# EAGLE schematic pmod_clock.961c7fa4 (EAGLE 6.5.4)
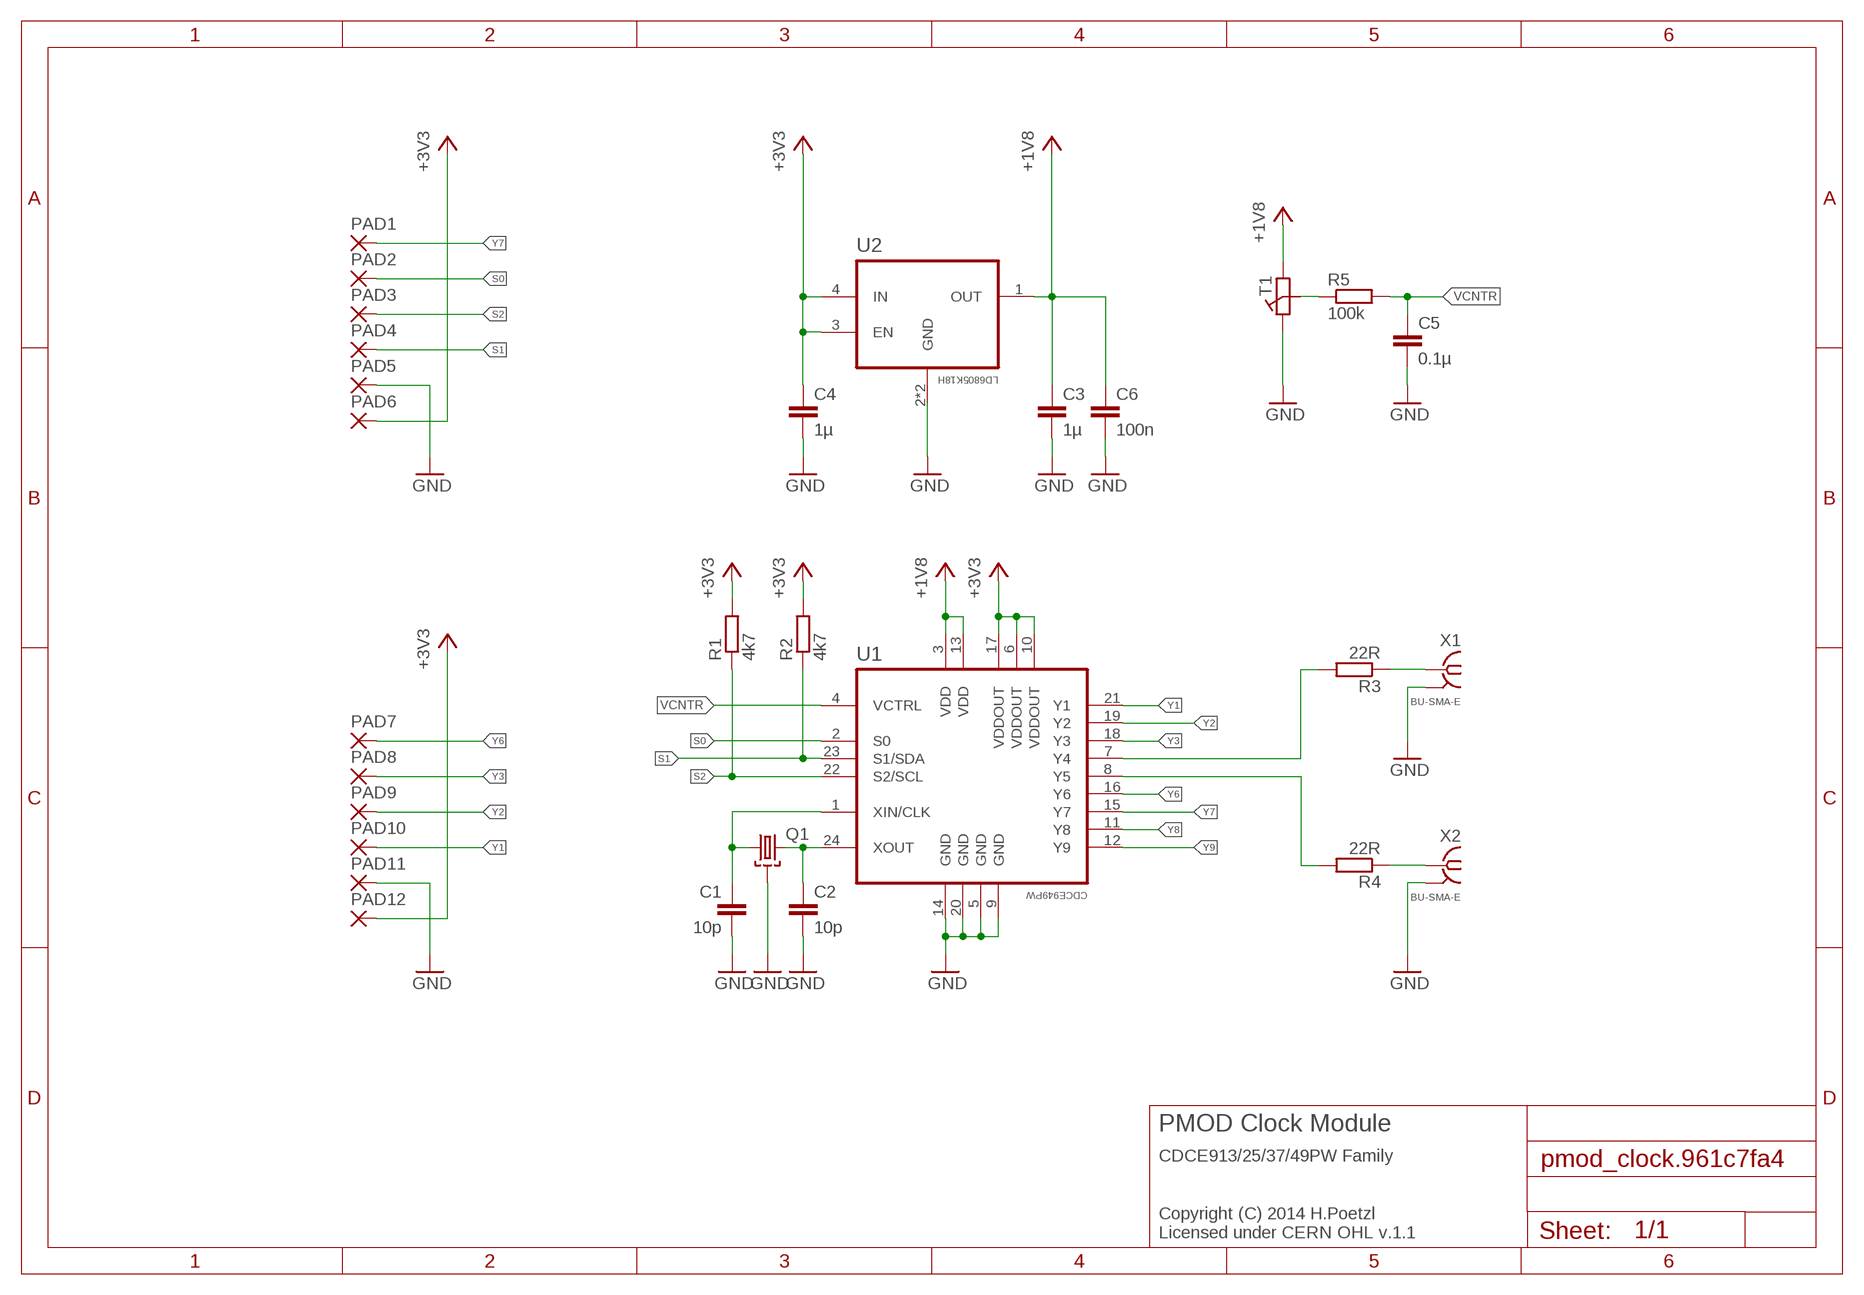
[diagram p0: schematic, sheet 1]

## Parts
C1  10p  C-EUC0402K  [C0402K]
C2  10p  C-EUC0402K  [C0402K]
C3  1µ  C-EUC0402  [C0402]
C4  1µ  C-EUC0402  [C0402]
C5  0.1µ  C-EUC0402  [C0402]
C6  100n  C-EUC0402  [C0402]
PAD1  SMD2HR  [SMD1.27-3.175HR]
PAD2  SMD2HR  [SMD1.27-3.175HR]
PAD3  SMD2HR  [SMD1.27-3.175HR]
PAD4  SMD2HR  [SMD1.27-3.175HR]
PAD5  SMD2HR  [SMD1.27-3.175HR]
PAD6  SMD2HR  [SMD1.27-3.175HR]
PAD7  SMD2HR  [SMD1.27-3.175HR]
PAD8  SMD2HR  [SMD1.27-3.175HR]
PAD9  SMD2HR  [SMD1.27-3.175HR]
PAD10  SMD2HR  [SMD1.27-3.175HR]
PAD11  SMD2HR  [SMD1.27-3.175HR]
PAD12  SMD2HR  [SMD1.27-3.175HR]
Q1  SMD-4P-2G5.0X3.2+3.2X2.5  [MIX]
R1  4k7  R-EU_R0402  [R0402]
R2  4k7  R-EU_R0402  [R0402]
R3  22R  R-EU_R0402  [R0402]
R4  22R  R-EU_R0402  [R0402]
R5  100k  R-EU_R0402  [R0402]
T1  PVZ2A  [TRIM-PVZ2A]
U1  CDCE949PW  [SOP65P640X120-24N]
U2  LD6805K18H  [NXP_LD6805]
X1  BU-SMA-E  [SMA-EDGE]
X2  BU-SMA-E  [SMA-EDGE]

## Nets
+1V8: C3.1 C6.1 T1.1(A) U1.3(VDD) U1.13(VDD) U2.1(OUT)
+3V3: C4.1 PAD6.1(P) PAD12.1(P) R1.2 R2.2 U1.6(VDDOUT) U1.10(VDDOUT) U1.17(VDDOUT) U2.3(EN) U2.4(IN)
GND: C1.2 C2.2 C3.2 C4.2 C5.2 C6.2 PAD5.1(P) PAD11.1(P) Q1.2(GND) Q1.2@(GND) Q1.4(GND) Q1.4@(GND) T1.3(C) U1.5(GND) U1.9(GND) U1.14(GND) U1.20(GND) U2.2(GND) U2.5(GND) X1.2@3 X1.2@4 X2.2@3 X2.2@4
N$1: C1.1 Q1.1 Q1.1@ U1.1(XIN/CLK)
N$4: C2.1 Q1.3 Q1.3@ U1.24(XOUT)
N$5: R4.1 X2.1
N$6: R3.1 X1.1
N$7: R5.1 T1.2(B)
N$12: R3.2 U1.7(Y4)
S0: PAD2.1(P) U1.2(S0)
S1: PAD4.1(P) R2.1 U1.23(S1/SDA)
S2: PAD3.1(P) R1.1 U1.22(S2/SCL)
VCNTR: C5.1 R5.2 U1.4(VCTRL)
Y1: PAD10.1(P) U1.21(Y1)
Y2: PAD9.1(P) U1.19(Y2)
Y3: PAD8.1(P) U1.18(Y3)
Y5: R4.2 U1.8(Y5)
Y6: PAD7.1(P) U1.16(Y6)
Y7: PAD1.1(P) U1.15(Y7)
Y8: U1.11(Y8)
Y9: U1.12(Y9)

## Notes on the sheet
- PMOD Clock Module
- CDCE913/25/37/49PW Family
- Copyright (C) 2014 H.Poetzl
  Licensed under CERN OHL v.1.1

## Library data of the parts
C1-C6 = rcl:C-EU: CAPACITOR, European symbol
PAD1-PAD12 = wirepad:SMD2: SMD PAD
Q1 = xtal:SMD-4P-2G
R1-R5 = rcl:R-EU_: RESISTOR, European symbol
T1 = paul:PVZ2A
U1 = cdce949:CDCE949: Programmable Clock Synthesizer; FARNELLORDERCODE: 1494886; MPN: CDCE949PW; NEWARKORDERCODE: 50M8835; PACKAGE: TSSOP-24; SUPPLIER: Texas Instruments
U2 = ld6805k:LD6805K: Low-dropout regulators, high PSRR, 150 mA, DFN1010C-4; MPN: LD6805K/18H; OC_FARNELL: 2095513; OC_NEWARK: 93T1635; PACKAGE: DFN1010C-4; SUPPLIER: NXP
X1 X2 = sma:BU-SMA-E